# EAGLE design untitled (EAGLE 6.3)
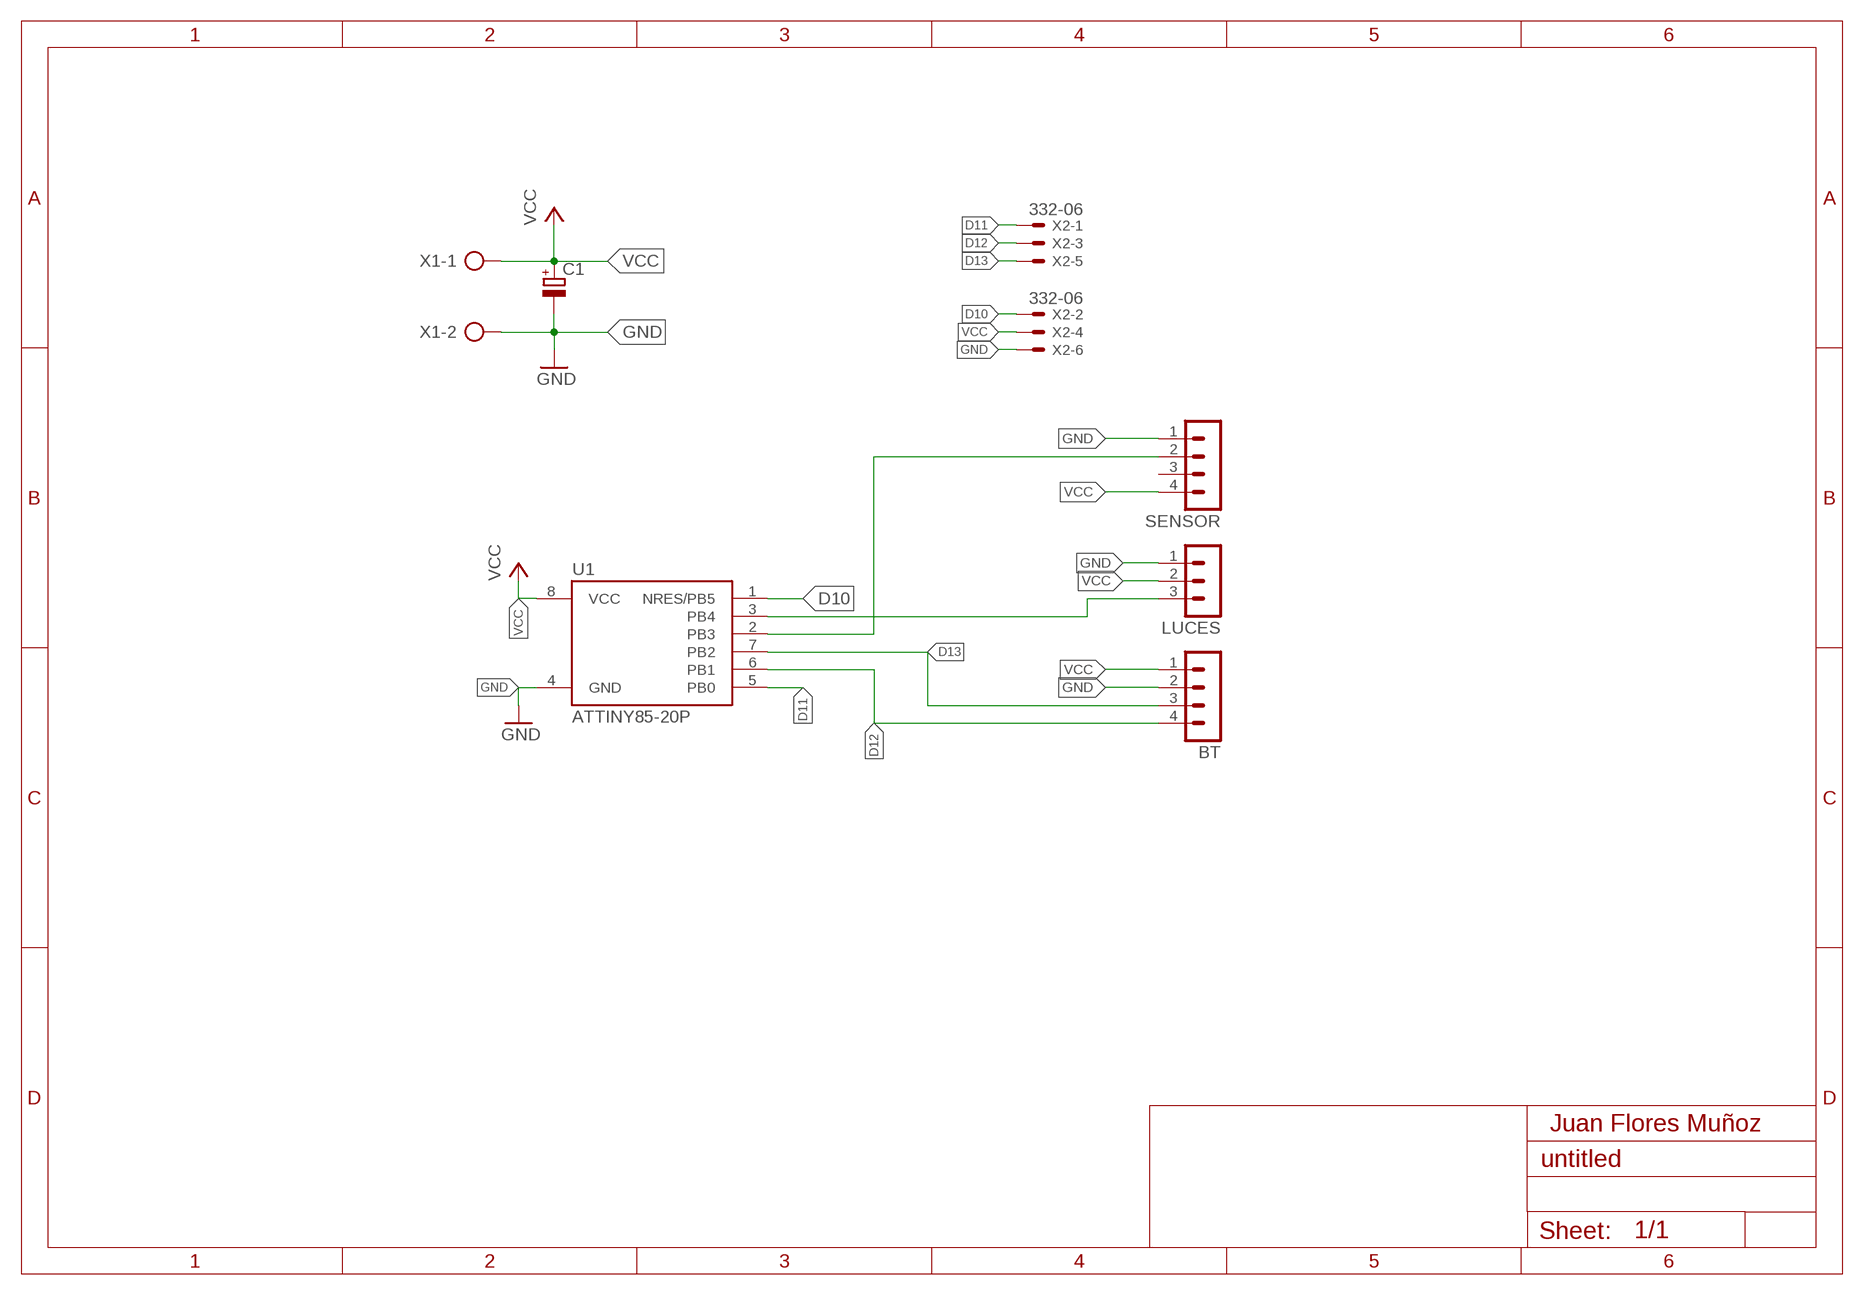
[diagram p0: schematic, sheet 1]

## Parts
BT  MA04-1  [MA04-1]
C1  CPOL-EUE2,5-6E  [E2,5-6E]
LUCES  MA03-1  [MA03-1]
SENSOR  MA04-1  [MA04-1]
U1  ATTINY85-20P  [PDIP08_300MIL]
X1  AK500/2  [AK500/2]
X2  332-06  [332-06]

## Nets
01: SENSOR.2 U1.2(PB3)
D10: U1.1(NRES/PB5) X2.2
D11: U1.5(PB0) X2.1
D12: BT.4 U1.6(PB1) X2.3
D13: BT.3 U1.7(PB2) X2.5
GND: BT.2 C1.- LUCES.1 SENSOR.1 U1.4(GND) X1.2 X2.6
N$2: LUCES.3 U1.3(PB4)
VCC: BT.1 C1.+ LUCES.2 SENSOR.4 U1.8(VCC) X1.1 X2.4
Unconnected: SENSOR.3

## Notes on the sheet
- Juan Flores Muñoz

## Library data of the parts
BT SENSOR = con-lstb:MA04-1: PIN HEADER; OC_FARNELL: unknown; OC_NEWARK: unknown
C1 = rcl:CPOL-EU: POLARIZED CAPACITOR, European symbol
LUCES = con-lstb:MA03-1: PIN HEADER; OC_FARNELL: unknown; OC_NEWARK: unknown
U1 = _hhn_attiny25_45_85:ATTINY85*: ATMEL ATtiny 85 Packages: P = PDIP 08 30mil S = SOIC 08 EIAJ 208mil Technologies Note: for complete ordering code (temp. range, finish, tape&reel etc.) see www.atmel.com • Supply Voltage: V = (1.8…5.5)V | [blank] = (2.7…5.5)V • Speed: 10 = 10 MHz | 20 = 20 MHz Author: Dipl.-Ing. FH Rainer Bayer HHN Hochschule Heilbronn (Heilbronn University), rainer.bayer@hs-heilbronn.de Ingenieurbüro ing-rb, mail@ing-rb.de
X1 = con-ptr500:AK500/2: CONNECTOR; OC_FARNELL: unknown; OC_NEWARK: unknown
X2 = con-garry:332-06: 6 Pin - 2mm Dual Row Source: www.mpe-connector.de / garry_shortform_2012.pdf

## Board
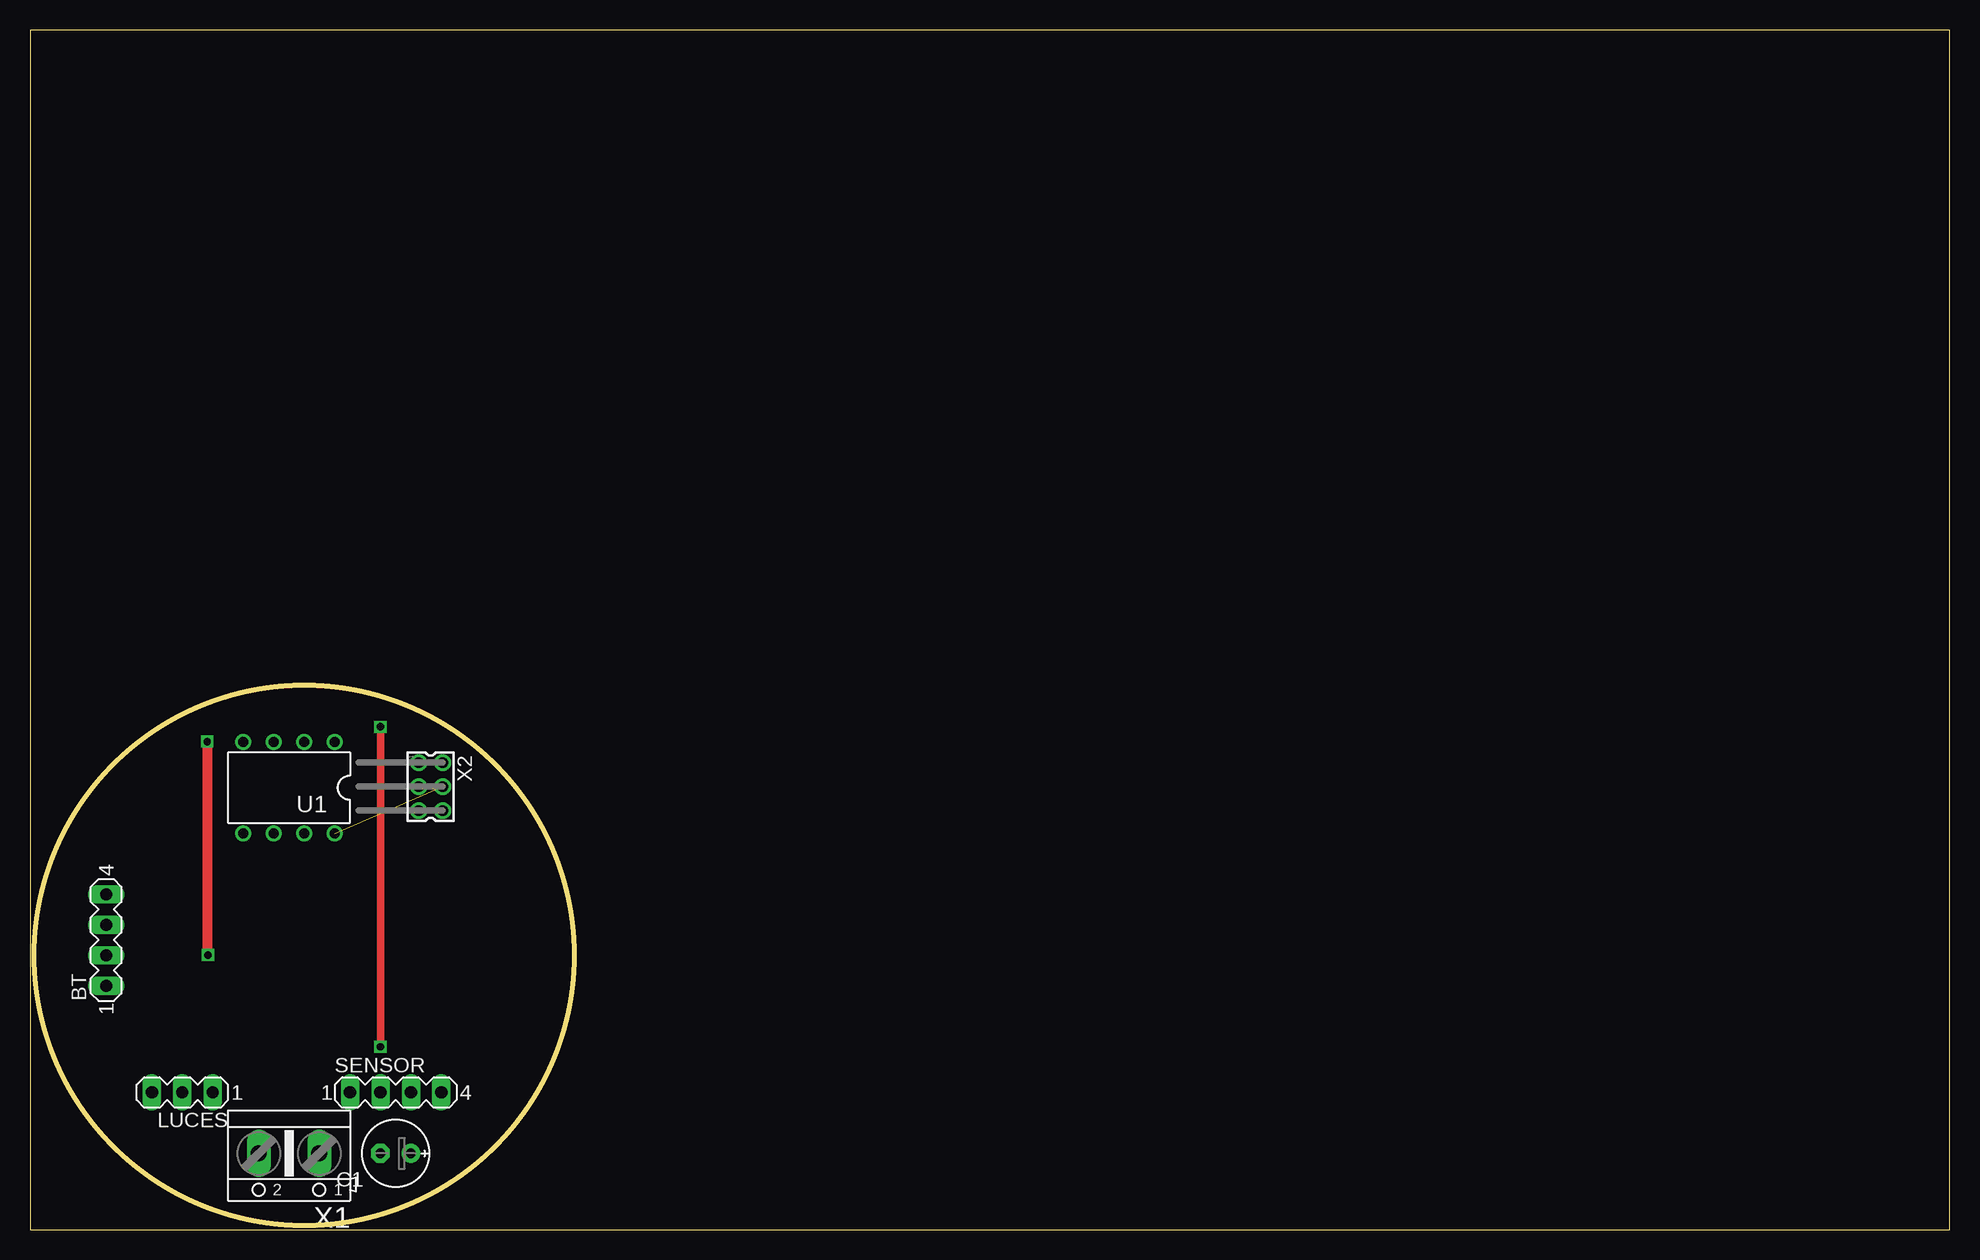
[diagram p1: board, top side]
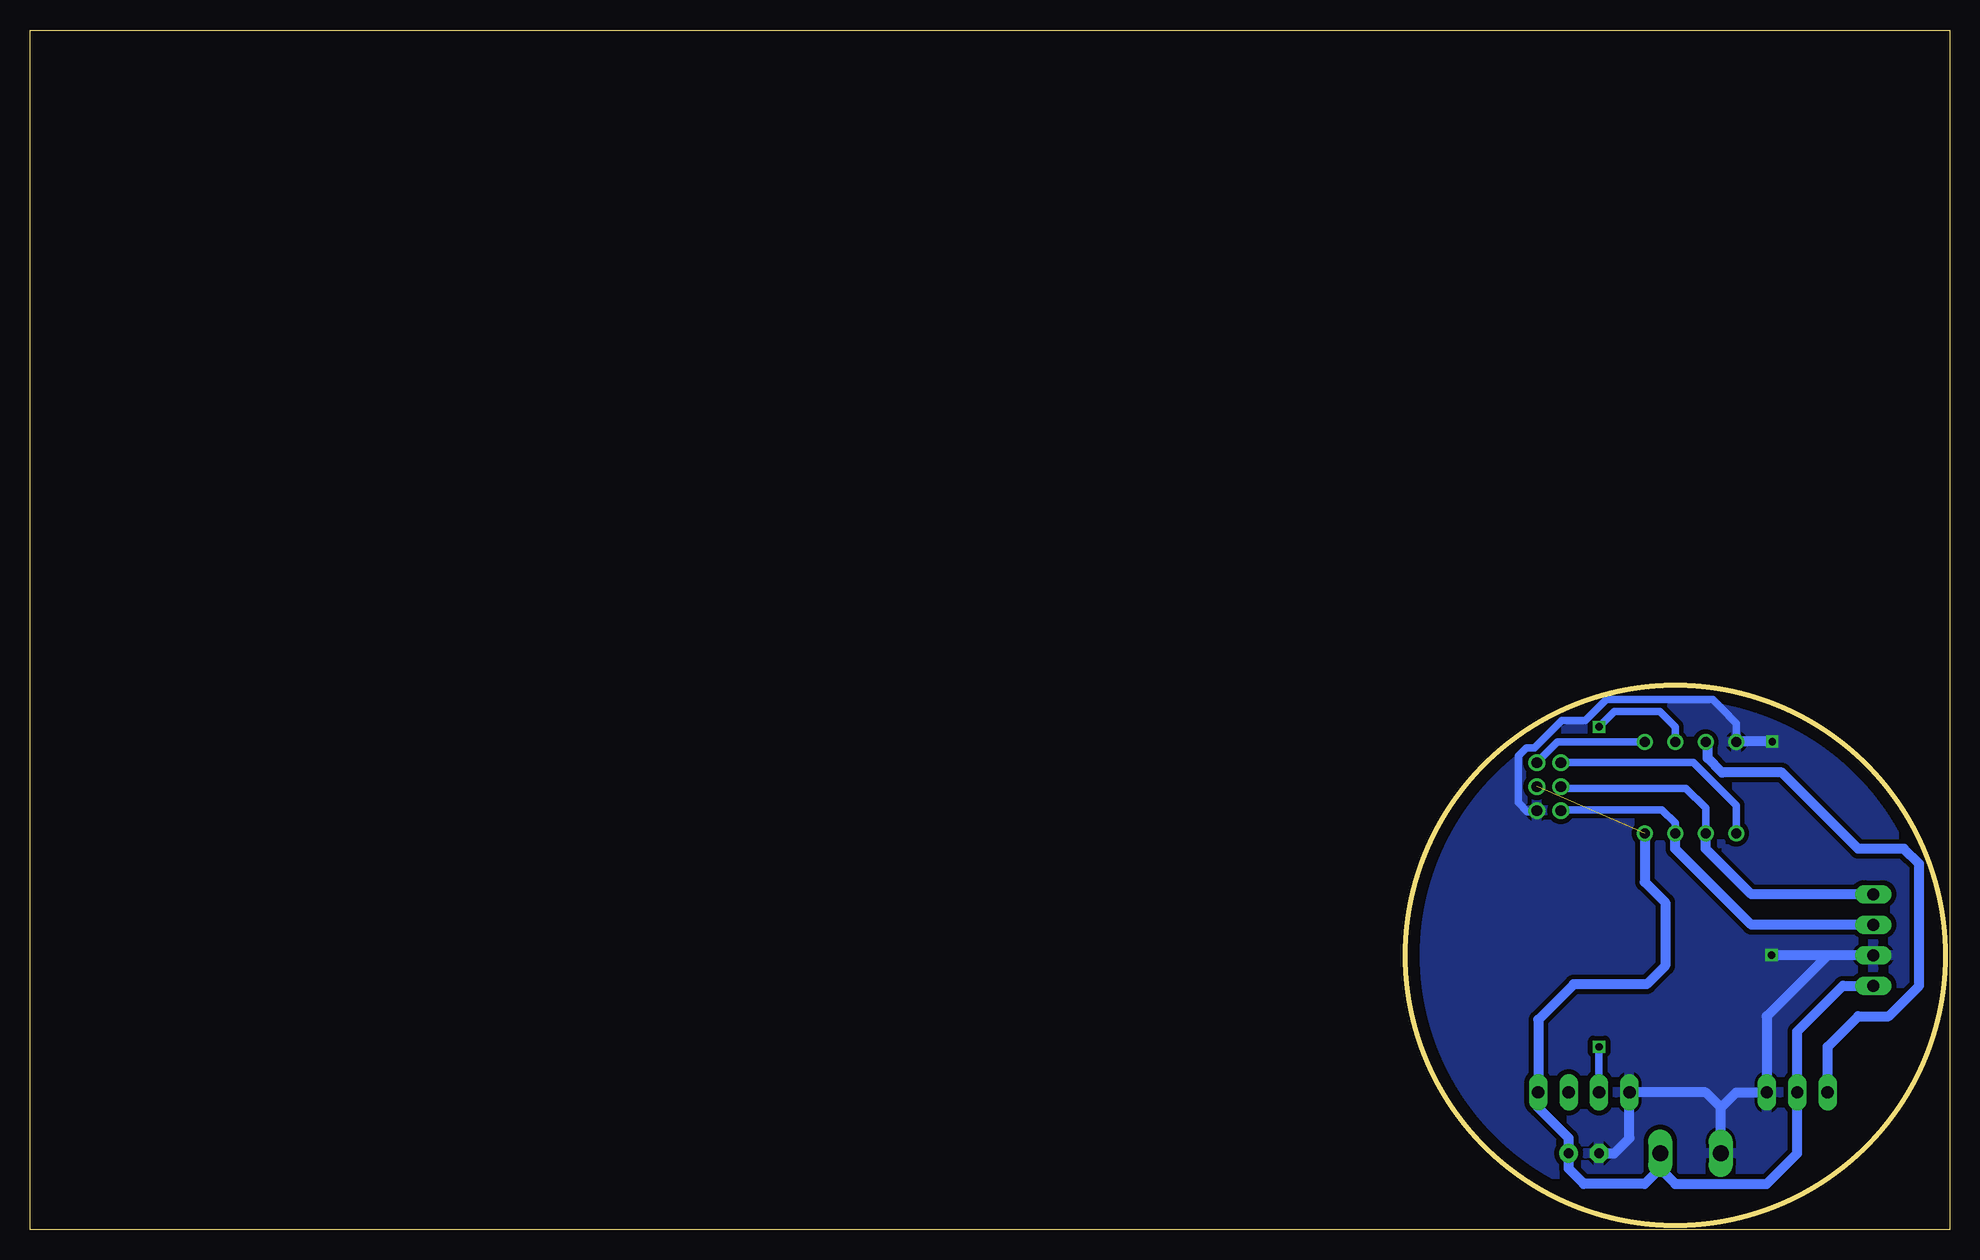
[diagram p2: board, bottom side, seen from below]

Size 160 x 100 mm. Coordinates in mm from the lower left corner, seen from the top.
Outline: 0,0 160,0 160,100 0,100 0,0
Outline: circle at 22.86,22.86 radius 22.5
Copper layers (1*16): Top 0.035mm / dielectric 1.5mm / Bottom 0.035mm
Design rules "default": minimum track width 10mil, minimum drill 24mil, track to track 8mil, track to pad 8mil, pad to pad 8mil, via to via 8mil, smd to smd 8mil, copper to edge 40mil, drill to drill 8mil, minimum pad ring 10mil, minimum via ring 8mil, stop-mask expansion 4mil, vias tented up to drill 0mil, thermal gap 10mil

### Footprints (pad centres in the part's own frame; a part is rotated, then mirrored left to right if it is on the bottom)
MA04-1 = drill 1.016 long: 1 -3.81,0; 2 -1.27,0; 3 1.27,0; 4 3.81,0
E2,5-6E = drill 0.813 pad 1.575: + -1.27,0 | drill 0.813 pad 1.575 octagon: - 1.27,0
MA03-1 = drill 1.016 long: 1 -2.54,0; 2 0,0; 3 2.54,0
PDIP08_300MIL = drill 0.813: 1 -3.81,-3.81; 2 -1.27,-3.81; 3 1.27,-3.81; 4 3.81,-3.81; 5 3.81,3.81; 6 1.27,3.81; 7 -1.27,3.81; 8 -3.81,3.81
AK500/2 = drill 1.321 long: 1 -2.515,0; 2 2.515,0
332-06 = drill 0.9 pad 1.27: 1 -2,-1; 2 -2,1; 3 0,-1; 4 0,1; 5 2,-1; 6 2,1

### Placement (x,y rotation side)
BT  6.35,24.13 90 top
C1  30.48,6.35 180 top
LUCES  12.7,11.43 180 top
SENSOR  30.48,11.43 0 top
U1  21.59,36.83 180 top
X1  21.59,6.35 180 top
X2  33.4,36.92 270 top

### Tracks (layer width: path | path; a pad name or v marks a point on that pad's centre or on a via)
01  (via drill 0.6)
  Top 0.61: v29.21,41.91 v29.21,15.24
  Bottom 0.61: U1.2 22.86,41.91 24.13,43.18 27.94,43.18 v29.21,41.91 | v29.21,15.24 SENSOR.2
D10
  Bottom 0.61: X2.2 32.67,40.64 U1.1
D11
  Bottom 0.61: U1.5 17.78,35.36 21.34,38.92 X2.1
D12
  Bottom 0.61: U1.6 20.32,35.14 21.96,36.78 32.26,36.78 X2.3
  Bottom 0.813: BT.4 16.51,27.94 20.32,31.75 U1.6
D13
  Bottom 0.61: U1.7 22.86,33.89 23.96,34.99 32.32,34.99 X2.5
  Bottom 0.813: BT.3 16.51,25.4 22.86,31.75 U1.7
GND  (via drill 0.6)
  Top 0.813: v14.83,22.88 14.83,40.62 v14.77,40.67
  Bottom 0.61: U1.4 17.78,42.2 18.4,42.83 18.4,42.86 19.72,44.18 28.62,44.18 30.36,42.44 32.29,42.44 34.59,40.15 35.27,40.15 35.95,39.46 35.95,35.59 35.18,34.82 34.49,34.82 X2.6
  Bottom 0.813: C1.- 27.94,6.35 26.67,7.62 SENSOR.1 20.32,11.43 19.07,10.19 X1.2 19.07,10.13 17.78,11.43 LUCES.1 15.24,17.78 10.16,22.86 | BT.2 10.16,22.86 | 10.16,22.86 14.81,22.86 v14.83,22.88 | v14.77,40.67 17.75,40.67 U1.4
  pour Bottom (isolate 0.406): 0.07,45.78 45.72,45.78 45.72,0 0,0 0,45.72
N$2
  Bottom 0.813: LUCES.3 10.16,15.24 7.62,17.78 5.08,17.78 2.54,20.32 2.54,30.48 3.81,31.75 7.62,31.75 13.97,38.1 18.96,38.1 20.16,39.3 20.16,40.48 U1.3
VCC  (1 unrouted)
  Bottom 0.813: BT.1 8.89,20.32 12.7,16.51 LUCES.2 12.7,6.35 15.24,3.81 22.86,3.81 24.11,5.05 X1.1 24.11,5.11 25.4,3.81 30.48,3.81 31.75,5.08 C1.+ 31.75,7.62 34.29,10.16 SENSOR.4 34.27,11.45 34.27,17.5 31.32,20.46 25.23,20.46 23.7,21.99 23.7,27.25 25.4,28.96 U1.8